# EAGLE design rapidshark-three-quarters-h-bridge-mk-1.0 (EAGLE 6.5.0)
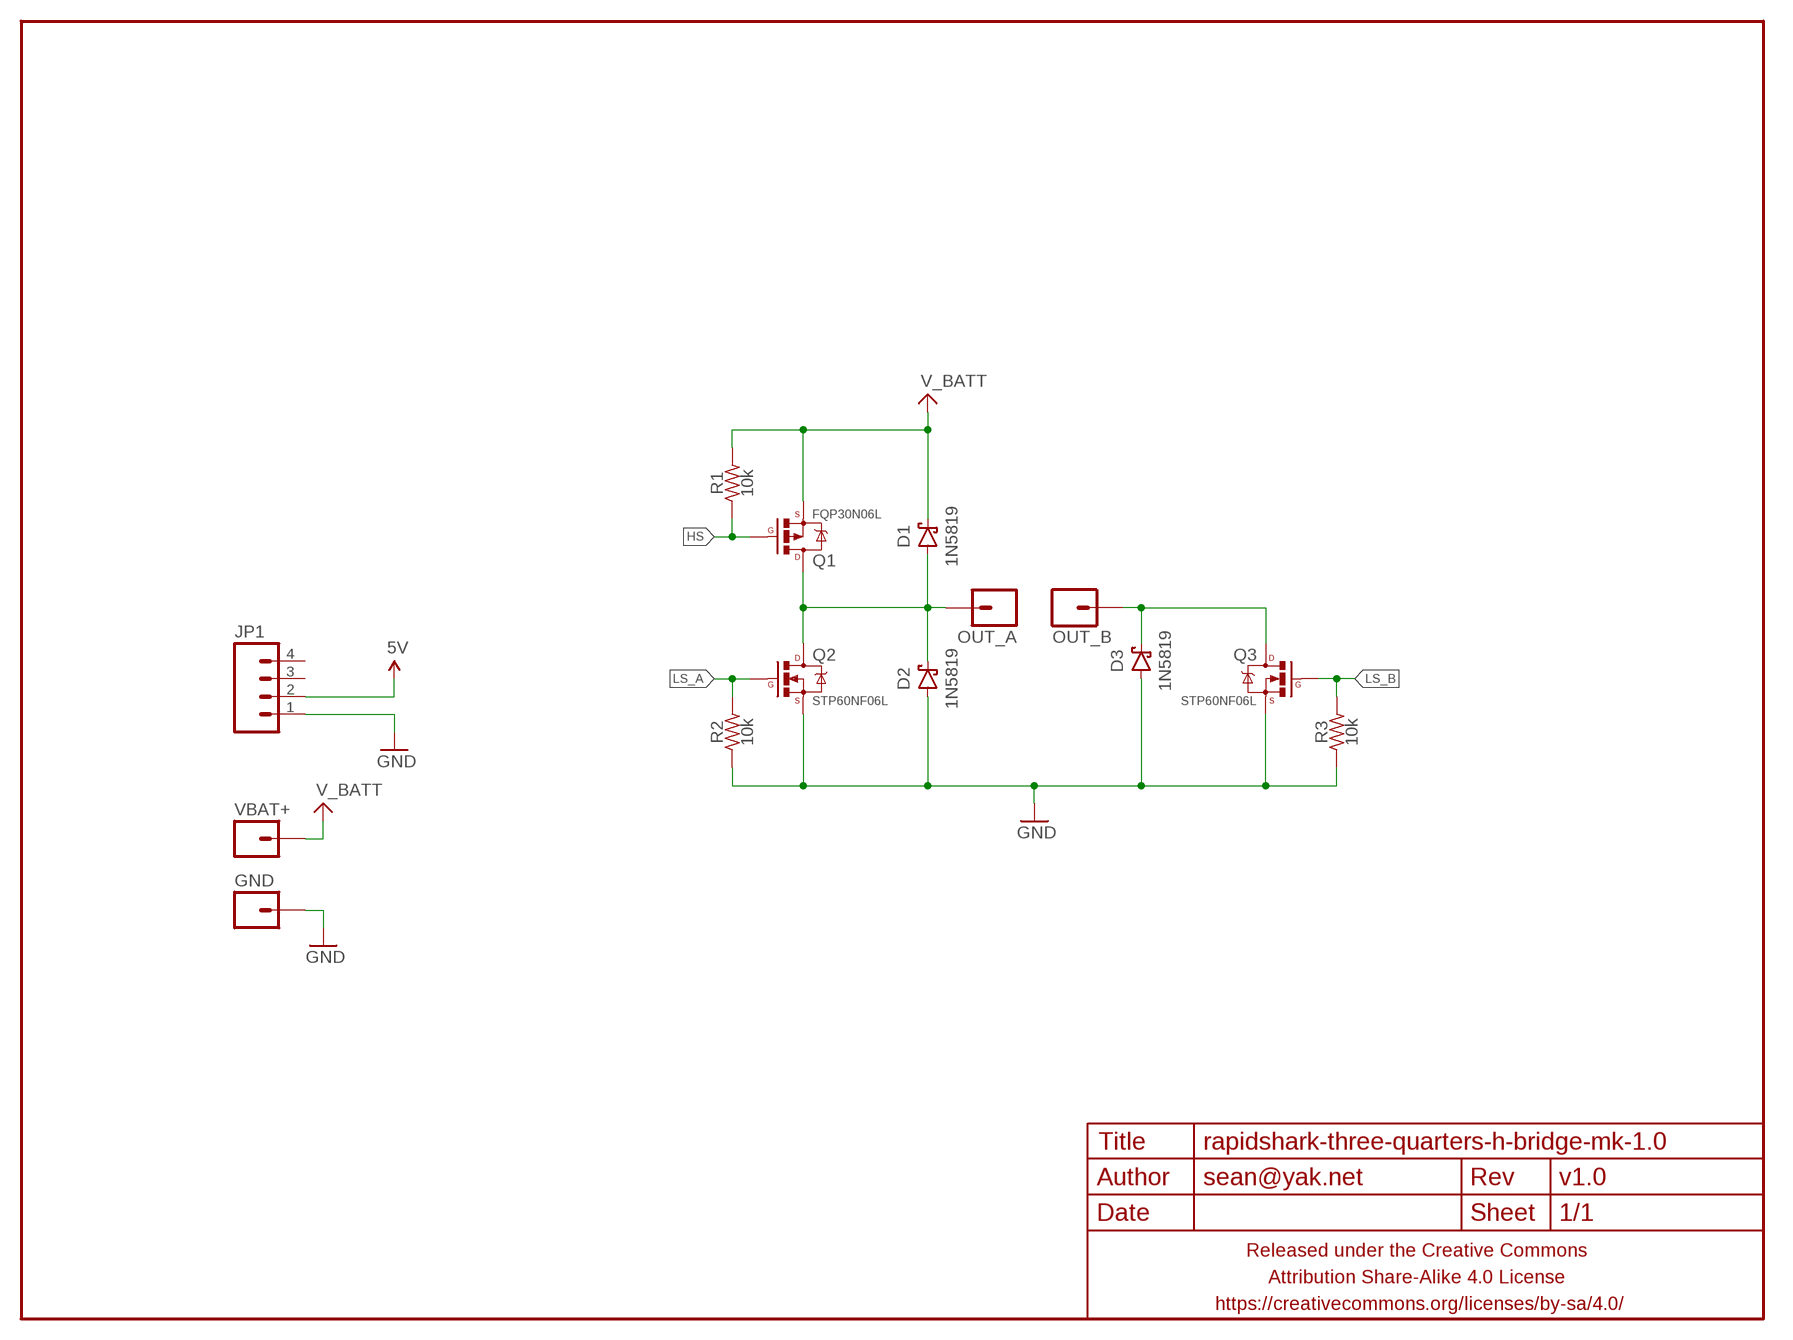
[diagram p0: schematic, sheet 1]

## Parts
D1  1N5819  DIODE-SCHOTTKYPTH-10.16MM  [DIODE-SCHOTTKY-10.16MM]
D2  1N5819  DIODE-SCHOTTKYPTH-10.16MM  [DIODE-SCHOTTKY-10.16MM]
D3  1N5819  DIODE-SCHOTTKYPTH-10.16MM  [DIODE-SCHOTTKY-10.16MM]
FRAME1  FRAME-LETTERNO_PACKAGE  [DUMMY]
GND  M0112AWG  [1X01-12AWG]
JP1  M04PTH  [1X04-PTH-VERT]
OUT_A  M0112AWG  [1X01-12AWG]
OUT_B  M0112AWG  [1X01-12AWG]
Q1  FQP30N06L  MOSFET-PCHANNELTO-220-THERMPAD  [TO220-THERMPAD]
Q2  STP60NF06L  MOSFET-NCHANNELTO-220  [TO220-THERMPAD]
Q3  STP60NF06L  MOSFET-NCHANNELTO-220  [TO220-THERMPAD]
R1  10k  RESISTORPTH-AXIAL-5.08MM  [RESISTOR-AXIAL-PTH-5.08MM]
R2  10k  RESISTORPTH-AXIAL-5.08MM  [RESISTOR-AXIAL-PTH-5.08MM]
R3  10k  RESISTORPTH-AXIAL-5.08MM  [RESISTOR-AXIAL-PTH-5.08MM]
VBAT+  M0112AWG  [1X01-12AWG]

## Nets
5V: JP1.2
A: D1.A D2.C OUT_A.1 Q1.2@1(D) Q1.2@2(D) Q2.2@1(D) Q2.2@2(D)
GND: D2.A D3.A GND.1 JP1.1 Q2.3(S) Q3.3(S) R2.P$1 R3.P$1
HS: Q1.1(G) R1.P$1
LS_A: Q2.1(G) R2.P$2
LS_B: Q3.1(G) R3.P$2
N$1: D3.C OUT_B.1 Q3.2@1(D) Q3.2@2(D)
V_BATT: D1.C Q1.3(S) R1.P$2 VBAT+.1
Unconnected: JP1.3 JP1.4

## Library data of the parts
D1-D3 = A_butts:DIODE-SCHOTTKY: Schottky diodes in SFE's production catalog BAT20J 1A 23V 0.62Vf RB751 120mA 40V 0.37Vf PMEG4005EJ 0.5A 40V 0.42Vf MBRA140 1A 40V 0.5Vf B340A 3A 40V SMA
FRAME1 = A_butts:FRAME-LETTER: Schematic Frame Standard 8.5x11 US Letter frame; DESIGNER: sean@yak.net; VERSION: v1.0
GND OUT_A OUT_B VBAT+ = A_butts:M01: Header 1 Standard 1-pin 0.1" header. Use with straight break away headers (SKU : PRT-00116), right angle break away headers (PRT-00553), swiss pins (PRT-00743), machine pins (PRT-00117), and female headers (PRT-00115).
JP1 = A_butts:M04: Header 4 Standard 4-pin 0.1" header. Use with straight break away headers (SKU : PRT-00116), right angle break away headers (PRT-00553), swiss pins (PRT-00743), machine pins (PRT-00117), and female headers (PRT-00115). Molex polarized connector foot print use with SKU : PRT-08231 with associated crimp pins and housings. 1MM SMD Version SKU: PRT-10208
Q1 = A_butts:MOSFET-PCHANNEL: Generic PMOSFET IRLML2244 - TRANS-11153 (SOT-23 -20V -4.3A) (1.Gate 2.Source 3.Drain) FQP27P06 - COM-10349 <http://www.sparkfun.com/products/10349> (TO-220 -60V -27A) (1.Gate 2.Source 3.Drain)
Q2 Q3 = A_butts:MOSFET-NCHANNEL: Common NMOSFET Parts MFG P/N Store ID Prod ID FDD8780 TRANS-09984 SI7820DN TRANS-11055 FDS6630A IC-08089 2N7002PW TRANS-11151 FQP30N06L COM-10213 TRANS-10060 BSS123LT1G TRANS-08345 BSS138 TRANS-00830 BS170 2N7000
R1-R3 = a_parts:RESISTOR: RESISTOR, American symbol

## Board
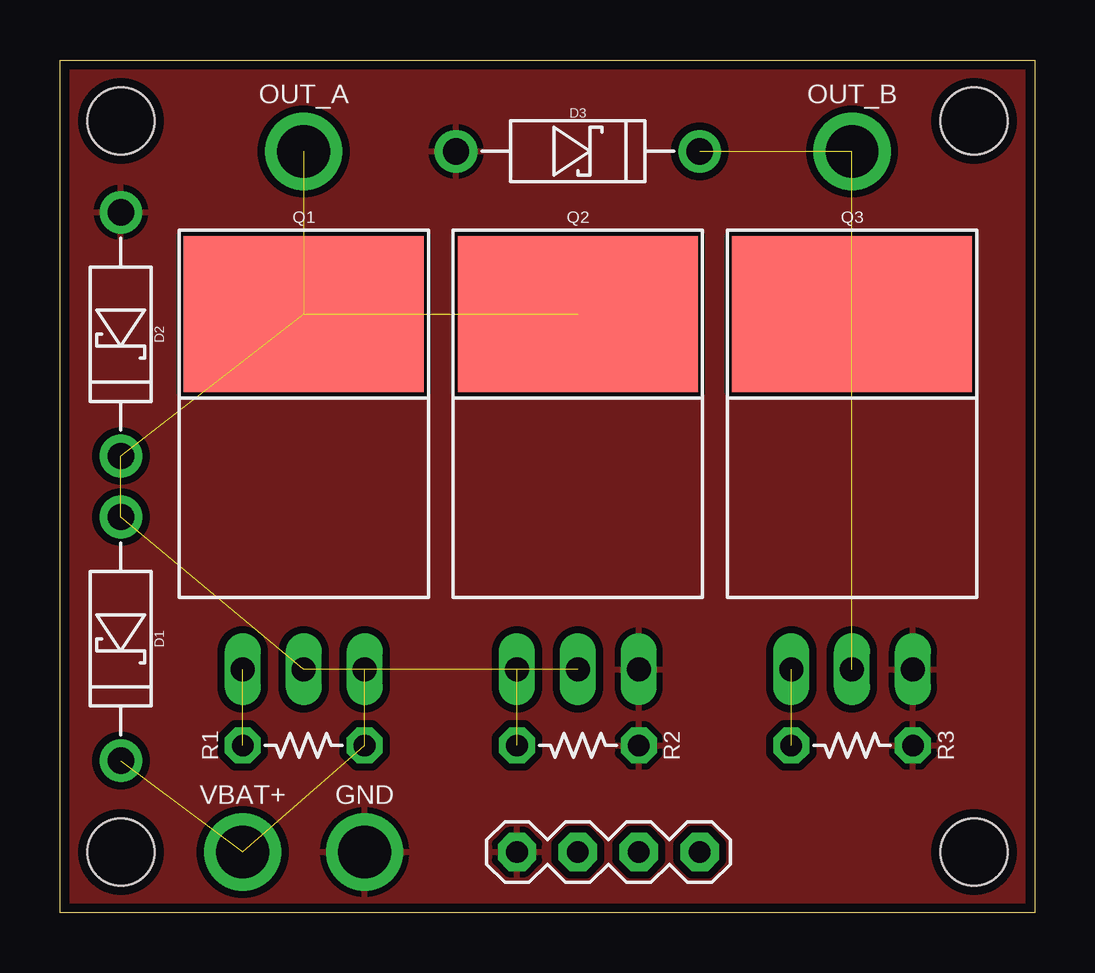
[diagram p1: board, top side]

Size 40.64 x 35.56 mm. Coordinates in mm from the lower left corner, seen from the top.
Outline: 40.64,35.56 40.64,0 0,0 0,35.56 40.64,35.56
Copper layers (1*16): Top 0.0356mm / dielectric 1.5011mm / Bottom 0.0356mm
Design rules "LaenPCBOrder_2": minimum track width 6mil, minimum drill 13mil, track to track 6mil, track to pad 6mil, pad to pad 6mil, via to via 6mil, smd to smd 6mil, copper to edge 15mil, drill to drill 6mil, minimum pad ring 7mil, minimum via ring 7mil, stop-mask expansion 3mil, vias tented up to drill 20mil, thermal gap 10mil
Holes 2.8 mm at 2.54,2.54 38.1,2.54 38.1,33.02 2.54,33.02

### Footprints (pad centres in the part's own frame; a part is rotated, then mirrored left to right if it is on the bottom)
DIODE-SCHOTTKY-10.16MM = drill 1.1 pad 1.778: A -5.08,0; C 5.08,0
1X01-12AWG = drill 2.2 pad 3.2: 1 0,0
1X04-PTH-VERT = drill 0.9 pad 1.6 octagon: 1 0,0; 2 2.54,0; 3 5.08,0; 4 7.62,0
TO220-THERMPAD = drill 1 long: 1 -2.54,0; 2@2 0,0; 3 2.54,0 | smd 10 x 6.5: 2@1 0,14.81
RESISTOR-AXIAL-PTH-5.08MM = drill 0.9 pad 1.5 octagon: P$1 -2.54,0; P$2 2.54,0

### Placement (x,y rotation side)
D1  2.54,11.43 270 top
D2  2.54,24.13 270 top
D3  21.59,31.75 0 top
FRAME1  0,0 0 bottom
GND  12.7,2.54 0 top
JP1  19.05,2.54 0 top
OUT_A  10.16,31.75 0 top
OUT_B  33.02,31.75 0 top
Q1  10.16,10.16 0 top
Q2  21.59,10.16 0 top
Q3  33.02,10.16 0 top
R1  10.16,6.99 0 top
R2  21.59,6.99 180 top
R3  33.02,6.99 180 top
VBAT+  7.62,2.54 0 top

### Tracks (layer width: path | path; a pad name or v marks a point on that pad's centre or on a via)
A  (6 unrouted)
GND
  pour Top (isolate 0.305, rank 5): 0,0 0,35.56 40.64,35.56 40.64,0
HS  (1 unrouted)
LS_A  (1 unrouted)
LS_B  (1 unrouted)
N$1  (3 unrouted)
V_BATT  (3 unrouted)